# Altium schematic sheet KEY.SchDoc
size A4; SheetNumber: 2; SheetTotal: 2
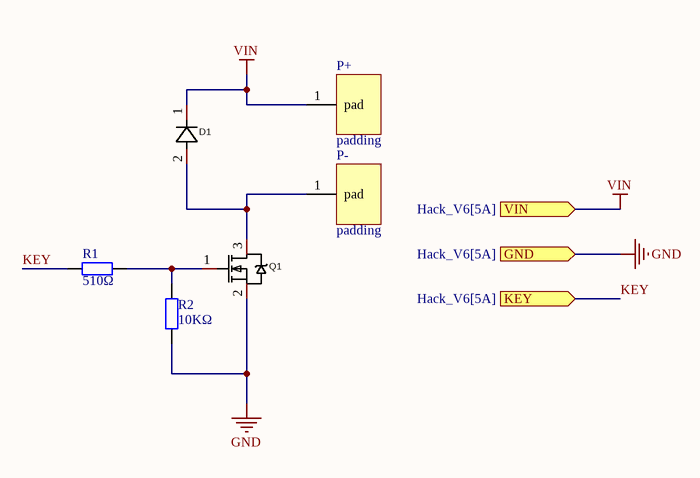
[diagram p0: KEY.SchDoc]

## Parts
D1  DSK16  [DSK16]  (value not drawn)
P+  padding  [PADDING1]
P-  padding  [PADDING1]
Q1  AO3442  [AO3442]  (value not drawn)
R1  510Ω  [0603_R]
R2  10KΩ  [0603_R]

## Ports
GND (in, see Hack_V6[5A]), KEY (in, see Hack_V6[5A]), VIN (in, see Hack_V6[5A])

## Nets
GND: Q1.2(S) R2.1 ; port GND
VIN: D1.1(K) P+.1(pad) ; port VIN
KEY: R1.1 ; port KEY
NetD1_2: D1.2(A) P-.1(pad) Q1.3(D)
NetQ1_1: Q1.1(G) R1.2 R2.2

## Library data of the parts
D1 = DSK16: Manufacturer: HXY MOSFET(华轩阳电子); Symbol: DSK16_C20611954; Add into BOM: yes; Diode Configuration: 独立式; Forward Voltage (Vf@If): 700mV@1A; Reverse Voltage (Vr): 60V; Average Rectified Current (Io): 1A; Name: DSK16; Device: DSK16_C20611954; LCSC Part Name: 电压:60V 电流:1A; Supplier Part: C20611954; Manufacturer Part: DSK16; Supplier Footprint: SOD-123FL; JLCPCB Part Class: Extended Part; Datasheet: https://atta.szlcsc.com/upload/public/pdf/source/20240126/50FF75CDB1A7B4BD07BEF0250A341C5F.pdf; Supplier: LCSC; Convert to PCB: yes; Reverse Leakage Current (Ir): -
P+ P- = padding1
Q1 = AO3442: Manufacturer: AOS; Add into BOM: yes; Type: N沟道; Drain Source Voltage (Vdss): 100V; Continuous Drain Current (Id): 1A; Power Dissipation (Pd): 1.4W; Drain Source On Resistance (RDS(on)@Vgs,Id): 630mΩ@10V,1A; Gate Threshold Voltage (Vgs(th)@Id): 2.9V@250uA; Total Gate Charge (Qg@Vgs): 6nC@10V; Input Capacitance (Ciss@Vds): 100pF@50V; Name: AO3442; Symbol: AO3442; Device: AO3442; LCSC Part Name: N沟道 耐压:100V 电流:1A; Supplier Part: C71064; Manufacturer Part: AO3442; Supplier Footprint: SOT-23-3L; JLCPCB Part Class: Extended Part; Datasheet: https://atta.szlcsc.com/upload/public/pdf/source/20160507/1462613612106.pdf; Supplier: LCSC; Convert to PCB: yes; Operating Temperature: -55℃~+150℃@(Tj)
R1 R2 = RES: resistance; ComponentLink1Description: 供应商链接; ComponentLink1URL: http://www.szlcsc.com/product/details_26562.html; Package: 0603; Supplier: LC; SuppliersPartNumber: C25819